# Altium schematic sheet RS485.SchDoc
size A
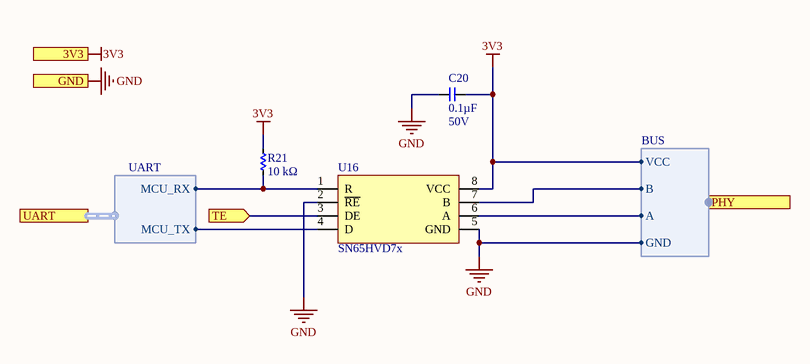
[diagram p0: RS485.SchDoc]

## Parts
C20  Capacitance (shorthand): 0.1µF  Rated Voltage: 50V  [C0603]  (hidden comment: 490-1519-1-ND)
R21  Resistance: 10 kΩ  [R0603]  (hidden comment: 311-10.0KHRCT-ND)
U16  SN65HVD7x  [8SOIC150]

## Ports
3V3 (in), GND (in), PHY (out, harness BUS), TE (in), UART (harness UART)

## Harnesses
UART: MCU_RX, MCU_TX
BUS: A, B, GND, VCC

## Nets
3V3: C20.2 R21.1 U16.8(VCC) ; port 3V3, port PHY.VCC
GND: C20.1 U16.2(~{RE}) U16.5(GND) ; port GND, port PHY.GND
TE: U16.3(DE) ; port TE
NetR21_2: R21.2 U16.1(R) ; port UART.MCU_RX
NetU16_4: U16.4(D) ; port UART.MCU_TX
NetU16_6: U16.6(A) ; port PHY.A
NetU16_7: U16.7(B) ; port PHY.B

## Library data of the parts
C20 = CMP-119-0065-1: CAP CER 0603 0.1µF X7R 50V 10%; Manufacturer: Murata Electronics North America; Capacitance - pF (Machine readable): #NAME?; Dielectric: X7R
R21 = CMP-126-0273-1: RES SMD 10K OHM 1% 1/10W 0603; Manufacturer Part Number: RC0603FR-0710KL; Manufacturer: Yageo; Power (Watts): 0.1W, 1/10W; Resistance (Sortable): 10000; Temperature Coefficient: ±100ppm/°C; Tolerance: ±1%; Datasheets: http://www.yageo.com/documents/recent/PYu-RC_Group_51_RoHS_L_9.pdf; Image: //media.digikey.com/Renders/Yageo%20Renders/0603-(1608-Metric).jpg; Operating Temperature: -55°C ~ 155°C
U16 = CMP-044-0003-1: Manufacturer: Texas Instruments; Manufacturer Part Number: SN65HVD72DGKR; Min Supply Voltage: 3V; Max Supply Voltage: 3.6V; Number of Receivers: 1; Output Current: 8mA; Data Rate: 0.25Mbps; Logic Function: Transceiver; Simplex/Duplex: Half Duplex; Supply Voltage: 3.3V; Nominal Supply Current: 950uA; Output Voltage: 2V; Propagation Delay: 0.7us; Interface: RS-485; Case/Package: VSSOP; Number of Pins: 8; Min Operating Temperature: -40°C; Max Operating Temperature: 125°C; Packaging: Tape and Reel; Package Quantity: 2500; Number of Drivers: 1; Number of Transmitters: 1; Number of Transceivers: 1; Radiation Hardening: No; Lead Free: Lead Free; REACH SVHC: No SVHC; ComponentLink1URL: https://datasheet.ciiva.com/28650/1787953-28650706.pdf; ComponentLink1Description: https://datasheet.ciiva.com/28650/1787953-28650706.pdf; ComponentLink2URL: https://datasheet.ciiva.com/24096/sn65hvd72-446416-24096821.pdf; ComponentLink2Description: https://datasheet.ciiva.com/24096/sn65hvd72-446416-24096821.pdf; ComponentLink3URL: https://datasheet.ciiva.com/6636/sn65hvd72-6636345.pdf; ComponentLink3Description: https://datasheet.ciiva.com/6636/sn65hvd72-6636345.pdf; ComponentLink4URL: https://datasheet.ciiva.com/26946/getdatasheetpartid-716725-26946073.pdf; ComponentLink4Description: https://datasheet.ciiva.com/26946/getdatasheetpartid-716725-26946073.pdf; ComponentLink5URL: https://datasheet.ciiva.com/6636/sn65hvd72-6636346.pdf; ComponentLink5Description: https://datasheet.ciiva.com/6636/sn65hvd72-6636346.pdf; ComponentLink6URL: https://datasheet.ciiva.com/6636/sn65hvd72-6636347.pdf; ComponentLink6Description: https://datasheet.ciiva.com/6636/sn65hvd72-6636347.pdf; ComponentLink7URL: https://datasheet.ciiva.com/14195/sn65hvd75-14195211.pdf; ComponentLink7Description: https://datasheet.ciiva.com/14195/sn65hvd75-14195211.pdf; ComponentLink8URL: https://datasheet.ciiva.com/41461/001187608-da-01-en-ic-txrx-rs485-sn65hvd72dgkr-vssop-8-tid-41461063.pdf; ComponentLink8Description: https://datasheet.ciiva.com/41461/001187608-da-01-en-ic-txrx-rs485-sn65hvd72dgkr-vssop-8-tid-41461063.pdf; Design Item ID: SN65HVD7x; Source: ic_digital.SchLib